# Altium schematic sheet uController_n_Ethernet.SchDoc
size 594 x 420 mm; SheetNumber: 9; SheetTotal: 11; SPICEModelCacheEHICLKKR: <root> / <DocumentId>EHICLKKR</DocumentId> / <CacheFrame Number="0"> / <Model Name="0603_885012206095_100nf" Kind="CKT"> / <Text>******* / .subckt 0603_885012206095_100nF 1 2 / Rser 1 3 0.0157659152881 / Lser 2 4 3.10171966E-10 / C1 3 4 0.0000001 / Rpar 3 4 5000000000 / .ends 0603_885012206095_100nF</Text> / </Model> / <Model Name="0603_885012106006_10uf" Kind="CKT"> / <Text>******* / .subckt 0603_885012106006_10uF 1 2 / Rser 1 3 0.00407641026021 / Lser 2 4 4.16060333E-10 / C1 3 4 0.00001 / Rpar 3 4 5000000 / .ends 0603_885012106006_10uF</Text> / </Model> / </CacheFrame> / </root>
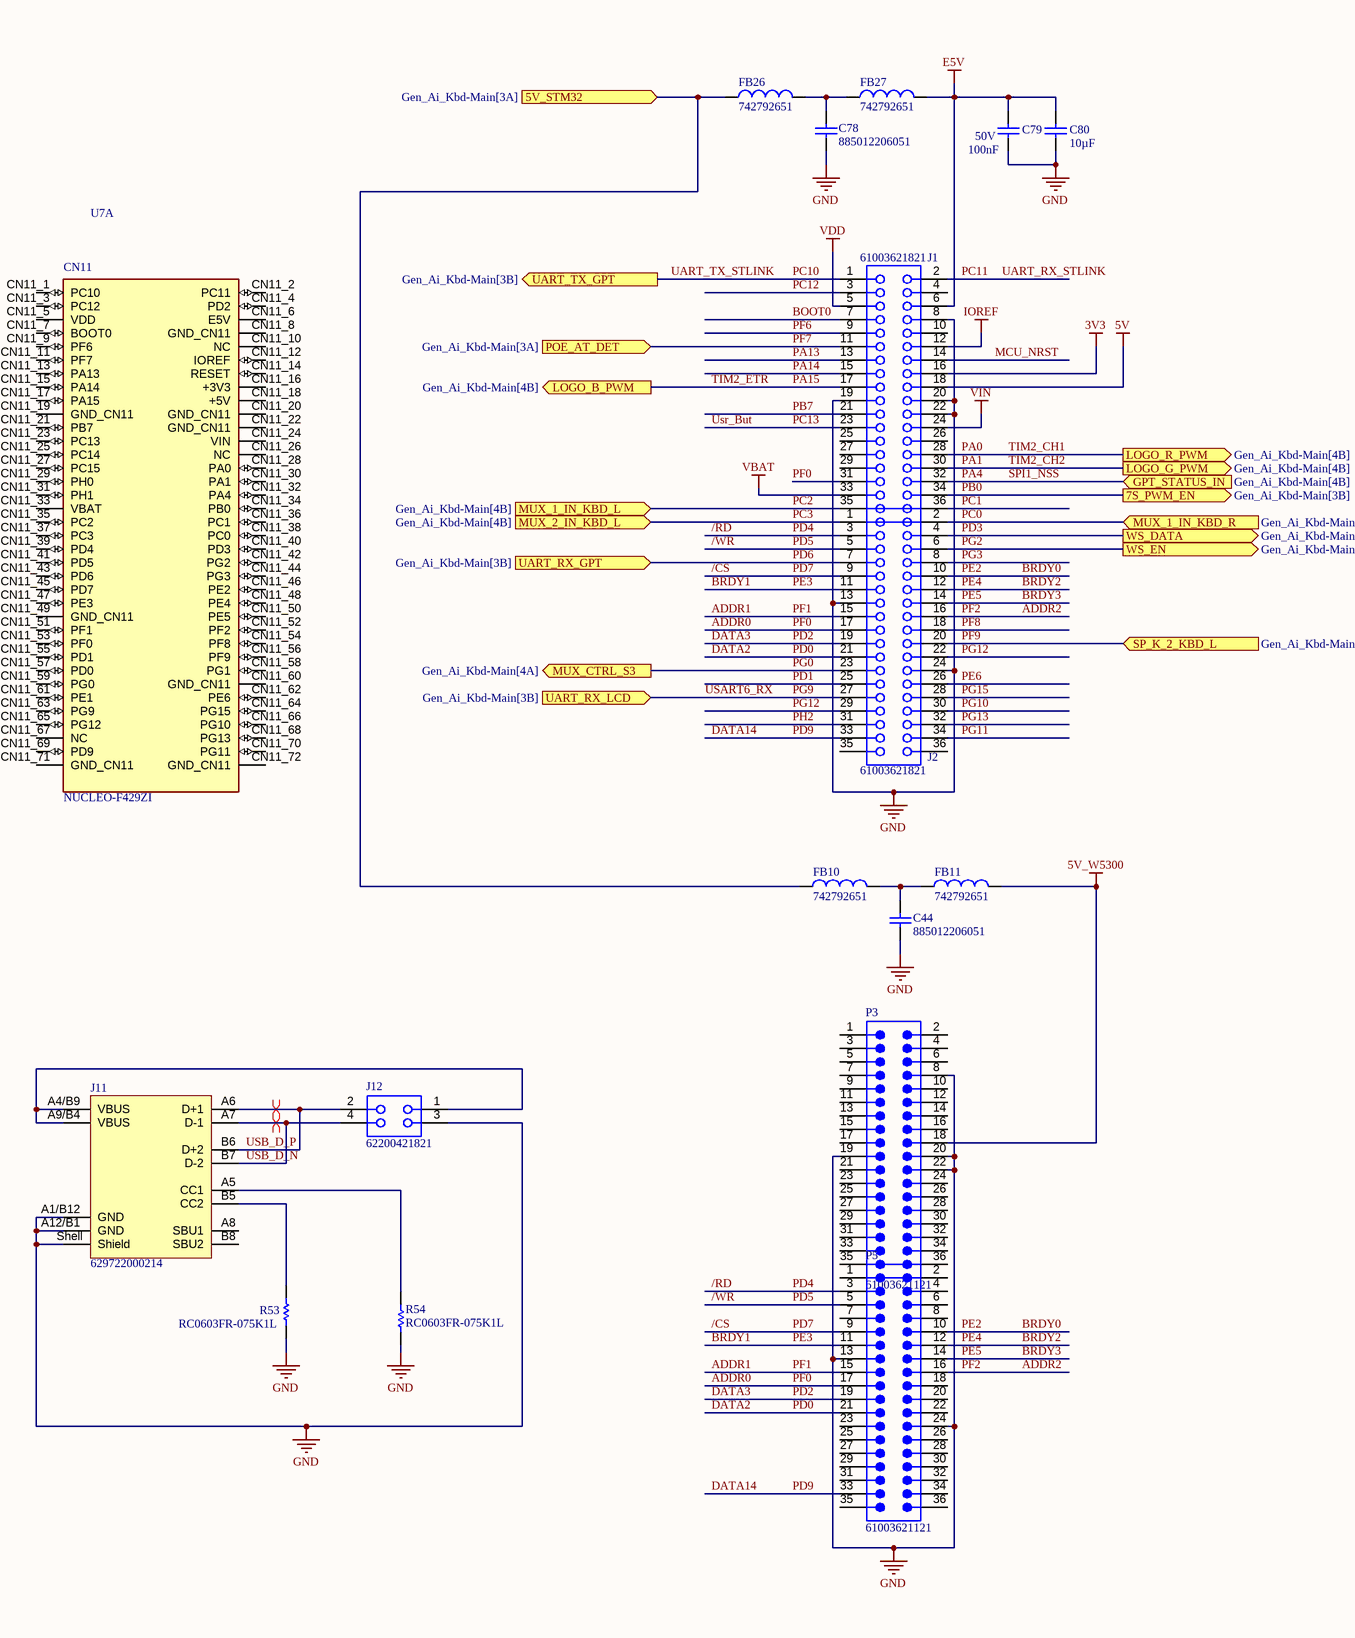
[diagram p0: uController_n_Ethernet.SchDoc, left]
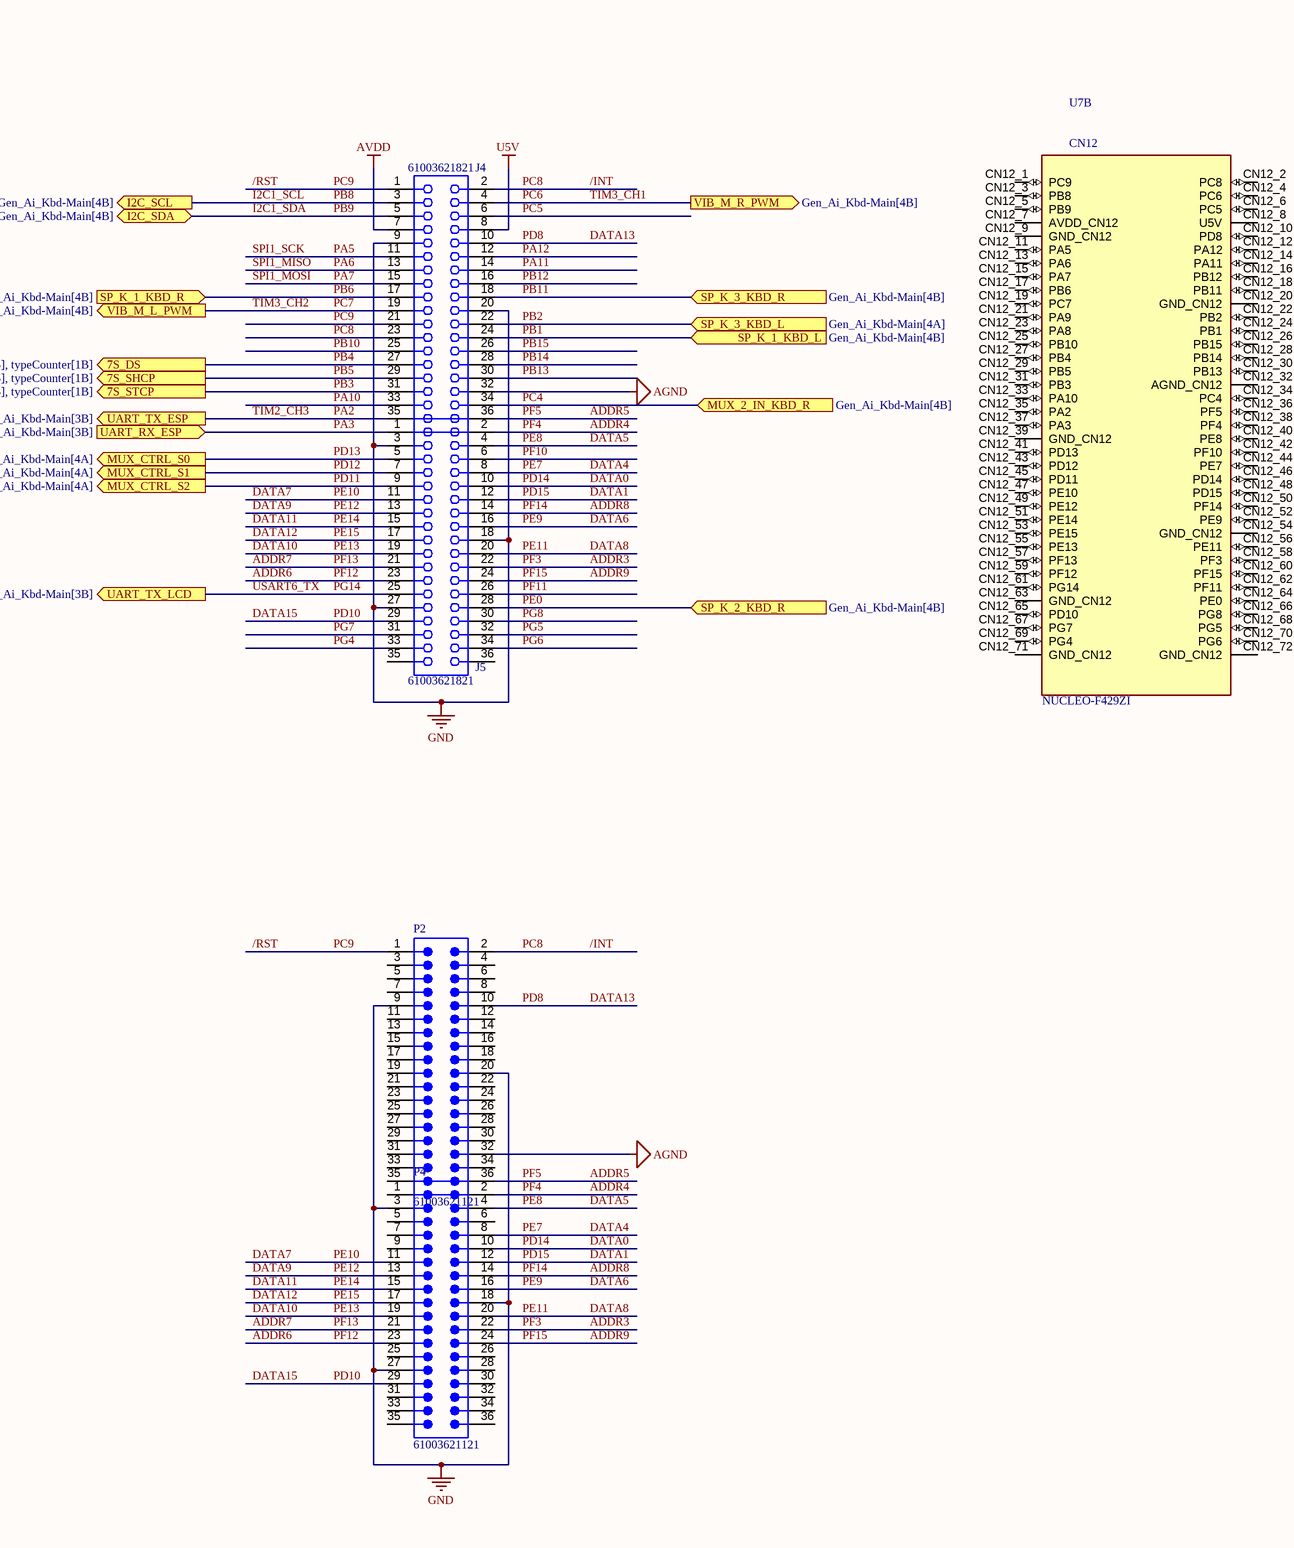
[diagram p1: uController_n_Ethernet.SchDoc, right]

## Parts
C44  885012206051  [WCAP-CSGP_0603_L1.6W0.8H0.8_Reflow]
C78  885012206051  [WCAP-CSGP_0603_L1.6W0.8H0.8_Reflow]
C79  Capacitance: 100nF  Rated Voltage (DC): 50V  [WCAP-CSGP_0603_L1.6W0.8H0.8_Reflow]  (hidden comment: 885012206095)
C80  Capacitance: 10µF  [WCAP-CSGP_0603_L1.6W0.8H0.8_Reflow]  (hidden comment: 885012106006)
FB10  742792651  [WE-CBF_0603_L1.6W0.8H0.8_HC]
FB11  742792651  [WE-CBF_0603_L1.6W0.8H0.8_HC]
FB26  742792651  [WE-CBF_0603_L1.6W0.8H0.8_HC]
FB27  742792651  [WE-CBF_0603_L1.6W0.8H0.8_HC]
J1  61003621821  [61003621821]
J2  61003621821  [61003621821]
J4  61003621821  [61003621821]
J5  61003621821  [61003621821]
J11  629722000214  [629722000214]
J12  62200421821  [62200421821]
P2  61003621121  [61003621121]
P3  61003621121  [61003621121]
P4  61003621121  [61003621121]
P5  61003621121  [61003621121]
R53  RC0603FR-075K1L  [RESC1608X55X25ML10T15]
R54  RC0603FR-075K1L  [RESC1608X55X25ML10T15]
U7  NUCLEO-F429ZI  [MODULE_NUCLEO-F429ZI]  (parts A,B of 6)

## Ports
5V_STM32 (in, see Gen_Ai_Kbd-Main[3A]), 7S_DS (out, see Gen_Ai_Kbd-Main[3B], typeCounter[1B]), 7S_PWM_EN (out, see Gen_Ai_Kbd-Main[3B]), 7S_SHCP (out, see Gen_Ai_Kbd-Main[3B], typeCounter[1B]), 7S_STCP (out, see Gen_Ai_Kbd-Main[3B], typeCounter[1B]), GPT_STATUS_IN (in, see Gen_Ai_Kbd-Main[4B]), I2C_SCL (out, see Gen_Ai_Kbd-Main[4B]), I2C_SDA (bidir, see Gen_Ai_Kbd-Main[4B]), LOGO_B_PWM (out, see Gen_Ai_Kbd-Main[4B]), LOGO_G_PWM (out, see Gen_Ai_Kbd-Main[4B]), LOGO_R_PWM (out, see Gen_Ai_Kbd-Main[4B]), MUX_1_IN_KBD_L (in, see Gen_Ai_Kbd-Main[4B]), MUX_1_IN_KBD_R (in, see Gen_Ai_Kbd-Main[4B]), MUX_2_IN_KBD_L (in, see Gen_Ai_Kbd-Main[4B]), MUX_2_IN_KBD_R (in, see Gen_Ai_Kbd-Main[4B]), MUX_CTRL_S0 (out, see Gen_Ai_Kbd-Main[4A]), MUX_CTRL_S1 (out, see Gen_Ai_Kbd-Main[4A]), MUX_CTRL_S2 (out, see Gen_Ai_Kbd-Main[4A]), MUX_CTRL_S3 (out, see Gen_Ai_Kbd-Main[4A]), POE_AT_DET (in, see Gen_Ai_Kbd-Main[3A]), SP_K_1_KBD_L (in, see Gen_Ai_Kbd-Main[4B]), SP_K_1_KBD_R (in, see Gen_Ai_Kbd-Main[4B]), SP_K_2_KBD_L (in, see Gen_Ai_Kbd-Main[4A]), SP_K_2_KBD_R (in, see Gen_Ai_Kbd-Main[4B]), SP_K_3_KBD_L (in, see Gen_Ai_Kbd-Main[4A]), SP_K_3_KBD_R (in, see Gen_Ai_Kbd-Main[4B]), UART_RX_ESP (in, see Gen_Ai_Kbd-Main[3B]), UART_RX_GPT (in, see Gen_Ai_Kbd-Main[3B]), UART_RX_LCD (in, see Gen_Ai_Kbd-Main[3B]), UART_TX_ESP (out, see Gen_Ai_Kbd-Main[3B]), UART_TX_GPT (out, see Gen_Ai_Kbd-Main[3B]), UART_TX_LCD (out, see Gen_Ai_Kbd-Main[3B]), VIB_M_L_PWM (out, see Gen_Ai_Kbd-Main[4B]), VIB_M_R_PWM (out, see Gen_Ai_Kbd-Main[4B]), WS_DATA (out, see Gen_Ai_Kbd-Main[3B]), WS_EN (out, see Gen_Ai_Kbd-Main[3B])

## Nets
3V3: J1.16
5V: J1.18
5V_W5300: FB11.2 P3.18
AGND: J4.32 P2.32
AVDD: J4.7
E5V: C79.2 C80.2 FB27.2 J1.6
GND: C44.1 C78.1 C79.1 C80.1 J1.8 J1.19 J1.20 J1.22 J2.13 J2.24 J4.9 J4.20 J5.3 J5.18 J5.27 J11.A1/B12(GND) J11.A12/B1(GND) J11.Shell(Shield) J12.3 P2.9 P2.20 P3.8 P3.19 P3.20 P3.22 P4.3 P4.18 P4.27 P5.13 P5.24 R53.1 R54.1
IOREF: J1.12
U5V: J4.8
VBAT: J1.33
VDD: J1.5
VIN: J1.24
5V_STM32: FB10.1 FB26.1 ; port 5V_STM32
/CS: J2.9 P5.9  [also labelled PD7]
/INT: J4.2 J4.23 P2.2  [also labelled PC8]
/RD: J2.3 P5.3  [also labelled PD4]
/RST: J4.1 J4.21 P2.1  [also labelled PC9]
/WR: J2.5 P5.5  [also labelled PD5]
ADDR0: J1.31 J2.17 P5.17  [also labelled PF0]
ADDR1: J2.15 P5.15  [also labelled PF1]
ADDR2: J2.16 P5.16  [also labelled PF2]
ADDR3: J5.22 P4.22  [also labelled PF3]
ADDR4: J5.2 P4.2  [also labelled PF4]
ADDR5: J4.36 P2.36  [also labelled PF5]
ADDR6: J5.23 P4.23  [also labelled PF12]
ADDR7: J5.21 P4.21  [also labelled PF13]
ADDR8: J5.14 P4.14  [also labelled PF14]
ADDR9: J5.24 P4.24  [also labelled PF15]
BOOT0: J1.7
BRDY0: J2.10 P5.10  [also labelled PE2]
BRDY1: J2.11 P5.11  [also labelled PE3]
BRDY2: J2.12 P5.12  [also labelled PE4]
BRDY3: J2.14 P5.14  [also labelled PE5]
DATA0: J5.10 P4.10  [also labelled PD14]
DATA1: J5.12 P4.12  [also labelled PD15]
DATA2: J2.21 P5.21  [also labelled PD0]
DATA3: J2.19 P5.19  [also labelled PD2]
DATA4: J5.8 P4.8  [also labelled PE7]
DATA5: J5.4 P4.4  [also labelled PE8]
DATA6: J5.16 P4.16  [also labelled PE9]
DATA7: J5.11 P4.11  [also labelled PE10]
DATA8: J5.20 P4.20  [also labelled PE11]
DATA9: J5.13 P4.13  [also labelled PE12]
DATA10: J5.19 P4.19  [also labelled PE13]
DATA11: J5.15 P4.15  [also labelled PE14]
DATA12: J5.17 P4.17  [also labelled PE15]
DATA13: J4.10 P2.10  [also labelled PD8]
DATA14: J2.33 P5.33  [also labelled PD9]
DATA15: J5.29 P4.29  [also labelled PD10]
I2C1_SCL: J4.3 ; port I2C_SCL  [also labelled PB8]
I2C1_SDA: J4.5 ; port I2C_SDA  [also labelled PB~{9}]
MCU_NRST: J1.14
PA0: J1.28 ; port LOGO_R_PWM  [also labelled TIM2_CH1]
PA1: J1.30 ; port LOGO_G_PWM  [also labelled TIM2_CH2]
PA2: J4.35 ; port UART_TX_ESP  [also labelled TIM2_CH3]
PA3: J5.1 ; port UART_RX_ESP
PA4: J1.32 ; port GPT_STATUS_IN  [also labelled SPI1_NSS]
PA5: J4.11  [also labelled SPI1_SCK]
PA6: J4.13  [also labelled SPI1_MISO]
PA7: J4.15  [also labelled SPI1_MOSI]
PA10: J4.33
PA11: J4.14
PA12: J4.12
PA13: J1.13
PA14: J1.15
PA15: J1.17 ; port LOGO_B_PWM  [also labelled TIM2_ETR]
PB0: J1.34 ; port 7S_PWM_EN
PB1: J4.24 ; port SP_K_1_KBD_L
PB2: J4.22 ; port SP_K_3_KBD_L
PB3: J4.31 ; port 7S_STCP
PB4: J4.27 ; port 7S_DS
PB5: J4.29 ; port 7S_SHCP
PB6: J4.17 ; port SP_K_1_KBD_R
PB7: J1.21
PB10: J4.25
PB11: J4.18 ; port SP_K_3_KBD_R
PB12: J4.16
PB13: J4.30
PB14: J4.28
PB15: J4.26
PC0: J2.2 ; port MUX_1_IN_KBD_R
PC1: J1.36
PC2: J1.35 ; port MUX_1_IN_KBD_L
PC3: J2.1 ; port MUX_2_IN_KBD_L
PC4: J4.34 ; port MUX_2_IN_KBD_R
PC5: J4.6
PC6: J4.4 ; port VIB_M_R_PWM  [also labelled TIM3_CH1]
PC7: J4.19 ; port VIB_M_L_PWM  [also labelled TIM3_CH2]
PC10: J1.1 ; port UART_TX_GPT  [also labelled UART_TX_STLINK]
PC11: J1.2  [also labelled UART_RX_STLINK]
PC12: J1.3
PC13: J1.23  [also labelled Usr_But]
PD1: J2.25
PD3: J2.4 ; port WS_DATA
PD6: J2.7 ; port UART_RX_GPT
PD11: J5.9 ; port MUX_CTRL_S2
PD12: J5.7 ; port MUX_CTRL_S1
PD13: J5.5 ; port MUX_CTRL_S0
PE0: J5.28 ; port SP_K_2_KBD_R
PE6: J2.26
PF6: J1.9
PF7: J1.11 ; port POE_AT_DET
PF8: J2.18
PF9: J2.20 ; port SP_K_2_KBD_L
PF10: J5.6
PF11: J5.26
PG0: J2.23 ; port MUX_CTRL_S3
PG2: J2.6 ; port WS_EN
PG3: J2.8
PG4: J5.33
PG5: J5.32
PG6: J5.34
PG7: J5.31
PG8: J5.30
PG9: J2.27 ; port UART_RX_LCD  [also labelled USART6_RX]
PG10: J2.30
PG11: J2.34
PG12: J2.22 J2.29
PG13: J2.32
PG14: J5.25 ; port UART_TX_LCD  [also labelled USART6_TX]
PG15: J2.28
PH2: J2.31
USB_D_N: J11.A7(D-1) J11.B7(D-2) J12.4
USB_D_P: J11.A6(D+1) J11.B6(D+2) J12.2
NetC44_2: C44.2 FB10.2 FB11.1
NetC78_2: C78.2 FB26.2 FB27.1
NetJ11_A4/B9: J11.A4/B9(VBUS) J11.A9/B4(VBUS) J12.1
NetJ11_A5: J11.A5(CC1) R54.2
NetJ11_B5: J11.B5(CC2) R53.2

Not connected (* = marked no-connect by the designer): J1 4 10 25 26 27 29; J2 35 36; J5 35 36; J11 A8(SBU1) B8(SBU2); P2 3 4 5 6 7 8 11 12 13 14 15 16 17 18 19 21 22 23 24 25 26 27 28 29 30 31 33 34 35; P3 1 2 3 4 5 6 7 9 10 11 12 13 14 15 16 17 21 23 24 25 26 27 28 29 30 31 32 33 34 35 36; P4 1 5 6 7 9 25 26 28 30 31 32 33 34 35 36; P5 1 2 4 6 7 8 18 20 22 23 25 26 27 28 29 30 31 32 34 35 36; U7 CN11_1(PC10) CN11_2(PC11) CN11_3(PC12) CN11_4(PD2) CN11_5(VDD) CN11_6(E5V) CN11_7(BOOT0) CN11_8(GND_CN11) CN11_9(PF6) CN11_10(NC) CN11_11(PF7) CN11_12(IOREF) CN11_13(PA13) CN11_14(RESET) CN11_15(PA14) CN11_16(+3V3) CN11_17(PA15) CN11_18(+5V) CN11_19(GND_CN11) CN11_20(GND_CN11) CN11_21(PB7) CN11_22(GND_CN11) CN11_23(PC13) CN11_24(VIN) CN11_25(PC14) CN11_26(NC) CN11_27(PC15) CN11_28(PA0) CN11_29(PH0) CN11_30(PA1) CN11_31(PH1) CN11_32(PA4) CN11_33(VBAT) CN11_34(PB0) CN11_35(PC2) CN11_36(PC1) CN11_37(PC3) CN11_38(PC0) CN11_39(PD4) CN11_40(PD3) CN11_41(PD5) CN11_42(PG2) CN11_43(PD6) CN11_44(PG3) CN11_45(PD7) CN11_46(PE2) CN11_47(PE3) CN11_48(PE4) CN11_49(GND_CN11) CN11_50(PE5) CN11_51(PF1) CN11_52(PF2) CN11_53(PF0) CN11_54(PF8) CN11_55(PD1) CN11_56(PF9) CN11_57(PD0) CN11_58(PG1) CN11_59(PG0) CN11_60(GND_CN11) CN11_61(PE1) CN11_62(PE6) CN11_63(PG9) CN11_64(PG15) CN11_65(PG12) CN11_66(PG10) CN11_67(NC) CN11_68(PG13) CN11_69(PD9) CN11_70(PG11) CN11_71(GND_CN11) CN11_72(GND_CN11) CN12_1(PC9) CN12_2(PC8) CN12_3(PB8) CN12_4(PC6) CN12_5(PB9) CN12_6(PC5) CN12_7(AVDD_CN12) CN12_8(U5V) CN12_9(GND_CN12) CN12_10(PD8) CN12_11(PA5) CN12_12(PA12) CN12_13(PA6) CN12_14(PA11) CN12_15(PA7) CN12_16(PB12) CN12_17(PB6) CN12_18(PB11) CN12_19(PC7) CN12_20(GND_CN12) CN12_21(PA9) CN12_22(PB2) CN12_23(PA8) CN12_24(PB1) CN12_25(PB10) CN12_26(PB15) CN12_27(PB4) CN12_28(PB14) CN12_29(PB5) CN12_30(PB13) CN12_31(PB3) CN12_32(AGND_CN12) CN12_33(PA10) CN12_34(PC4) CN12_35(PA2) CN12_36(PF5) CN12_37(PA3) CN12_38(PF4) CN12_39(GND_CN12) CN12_40(PE8) CN12_41(PD13) CN12_42(PF10) CN12_43(PD12) CN12_44(PE7) CN12_45(PD11) CN12_46(PD14) CN12_47(PE10) CN12_48(PD15) CN12_49(PE12) CN12_50(PF14) CN12_51(PE14) CN12_52(PE9) CN12_53(PE15) CN12_54(GND_CN12) CN12_55(PE13) CN12_56(PE11) CN12_57(PF13) CN12_58(PF3) CN12_59(PF12) CN12_60(PF15) CN12_61(PG14) CN12_62(PF11) CN12_63(GND_CN12) CN12_64(PE0) CN12_65(PD10) CN12_66(PG8) CN12_67(PG7) CN12_68(PG5) CN12_69(PG4) CN12_70(PG6) CN12_71(GND_CN12) CN12_72(GND_CN12)

## Layout directives
differential pair: USB_D_N, USB_D_P

## Notes on the sheet
- DWG NO:
- REV:
- REVISION
- DESCRIPTION
- DATE
- APPROVED
- PROJECT
- sumasta
- t
- PROJECT REVISION:
- TITLE
- DOCUMENT REVISION:
- DESIGN ITEM:
- SCALE:
- A2
- SIZE
- CAGE CODE
- FILE NAME
- DWG NO.
- SHEET
- OF
- REV
- (in symbol CMP-017-000000-2, part A) CN11
- (in symbol CMP-017-000000-2, part B) CN12

## Library data of the parts
C44 C78 = CMP-03913-53914760-1: 885012206051 Cap Cer 0.68UF 16V X7R 0603; Insulation Resistance: 700MΩ; Tolerance: 10%; Capacitance: 680nF; NexarPartId: 53914760; Dielectric: X7R; Max Operating Temperature: 125°C; Thickness: 939.8µm; Case Code (Imperial): 0603; Length: 1.6mm; RoHS: Compliant; Min Operating Temperature: -55°C; Width: 800µm; Mount: Surface Mount; Height: 800µm; Case/Package: 0603; Case Code (Metric): 1608; Voltage Rating (DC): 16V; Packaging: Tape & Reel (TR); Voltage Rating: 16V
C79 = CMP-007-000655-1: WCAP-CSGP Multilayer Ceramic Chip Capacitor, General Purpose, size 0603, X7R, 100nF, 50VDC; Manufacturer: Wurth Elektronik; Capacitance Tolerance: +/-10%; Insulation Resistance: 5GO; Case/Size Code: 0603; Technical Reference: X7R0603104K050DFCT10000; Dissipation Factor: 3%; Operating Temperature Max: 125°C; Category: Multilayer Ceramic Chip Capacitors; ComponentLink1Description: Website Link; Manufacturer Part Number: 885012206095; Pin Count: 2; Ceramic Type: X7R; Component Type: Standard; Mount: Surface Mount; Operating Temperature Min: -55°C; Source: WCAP-CSGP.SchLib; ComponentLink2URL: https://www.we-online.com/redexpert/spec/885012206095?ad; Packaging: Tape and Reel; Match Code: WCAP-CSGP; Width: 0.8mm; ComponentLink1URL: https://www.we-online.com/redexpert/article/885012206095?ad; Height: 0.8mm; Design Item ID: 885012206095; Length: 1.6mm; ComponentLink2Description: Datasheet Link
C80 = CMP-007-000403-1: WCAP-CSGP Multilayer Ceramic Chip Capacitor, General Purpose, size 0603, X5R, 10µF, 6.3VDC; Manufacturer: Wurth Elektronik; Rated Voltage (DC): 6.3V; Insulation Resistance: 0.01GO; Technical Reference: X5R0603106M6R3DFCT10000; Dissipation Factor: 10%; Case/Size Code: 0603; Capacitance Tolerance: +/-20%; Mount: Surface Mount; Packaging: Tape and Reel; ComponentLink1URL: https://www.we-online.com/redexpert/article/885012106006?ad; Height: 0.8mm; ComponentLink2URL: https://www.we-online.com/redexpert/spec/885012106006?ad; Category: Multilayer Ceramic Chip Capacitors; Operating Temperature Max: 85°C; Operating Temperature Min: -55°C; Source: WCAP-CSGP.SchLib; Match Code: WCAP-CSGP; Design Item ID: 885012106006; Ceramic Type: X5R; Manufacturer Part Number: 885012106006; Component Type: Standard; Pin Count: 2; Width: 0.8mm; ComponentLink2Description: Datasheet Link; ComponentLink1Description: Website Link; Length: 1.6mm
FB10 FB11 FB26 FB27 = CMP-0220-00181-3: NexarPartId: 7864500; RMS Current (Irms): 1A; Number of Lines: 1; Test Frequency: 100MHz; Impedance: 600Ω; Inductance: 360mH; Resistance: 200mΩ; Tolerance: 25%; Case Code (Imperial): 0603; Lead Free: Lead Free; Current Rating: 1A; Height: 800µm; Min Operating Temperature: -55°C; Core Material: Ferrite; REACH SVHC: Unknown; Case/Package: 0603; Weight: 3.997283mg; Mount: Surface Mount; Termination: SMD/SMT; Case Code (Metric): 1608; DC Resistance (DCR): 200mΩ; Series Resistance: 200mΩ; Max Operating Temperature: 125°C; Width: 800µm; Length: 1.6mm; Max DC Current: 1A; RoHS: Compliant; Material: Ferrite; Max Current Rating: 1A; Depth: 800µm; Packaging: Cut Tape (CT)
J1 J2 J4 J5 = CMP-1502-01300-2: NexarPartId: 65162132; Operating Supply Voltage: 250V; Contact Resistance: 20mΩ; Gender: Female; Current Rating: 3A; Lead Pitch: 2.54mm; Number of Pins: 36; Orientation: Vertical
J11 = CMP-207978-000003-2: Conenctor USB 2.0 Type C Horizontal SMT; NexarPartId: 129483980; USB Standard: USB 2.0; Gender: Receptacle; Current Rating: 5A; Insulation Resistance: 100MΩ; Pin Length: 950µm; Voltage Rating: 20V; Number of Contacts: 12; Height: 3.51mm; Packaging: Tape and Reel; Number of Pins: 16; Min Operating Temperature: -40°C; Max Operating Temperature: 85°C; RoHS: Compliant; Contact Material: Gold, Nickel
J12 = CMP-1502-01179-2: NexarPartId: 65162209; Contact Resistance: 20mΩ; Gender: Female; Current Rating: 1A; Operating Supply Voltage: 250V; Lead Pitch: 1.27mm; Contact Material: Copper; RoHS: Non-Compliant; Number of Pins: 4; Orientation: Vertical
P2-P5 = CMP-1502-01049-2: NexarPartId: 32855447; Gender: Male; Number of Contacts: 36; Connector Type: Male Pin; Pitch: 2.54mm; Contact Resistance: 20mΩ; Operating Supply Voltage: 250V; Current Rating: 3A; Termination: Solder; Contact Mating Length: 5.9944mm; Number of Rows: 2; REACH SVHC: Unknown; Color: Black; Contact Plating: Gold; Number of Pins: 36; Lead Pitch: 2.54mm; Mount: Surface Mount; Contact Material: Copper; Orientation: Vertical; RoHS: Compliant; Row Spacing: 2.54mm; Number of Positions: 36
R53 R54 = CMP-2000-04091-1: Manufacturer: Yageo; Part Number: RC0603FR-075K1L
U7 = CMP-017-000000-2: STM32F429ZI, mbed-Enabled Development Nucleo-144 STM32F4 ARMÂ® CortexÂ®-M4 MCU 32-Bit Embedded Evaluation Board; MF: STMicroelectronics; Component Type: Standard; Check_prices: https://www.snapeda.com/parts/NUCLEO-F429ZI/STMicroelectronics/view-part/?ref=eda; SnapEDA_Link: https://www.snapeda.com/parts/NUCLEO-F429ZI/STMicroelectronics/view-part/?ref=snap; Price: None; Design Item ID: NUCLEO-F429ZI; Value: *; Package: None; Availability: In Stock; Purchase-URL: https://pricing.snapeda.com/search/part/NUCLEO-F429ZI/?ref=eda; Source: NUCLEO-F429ZI.SchLib; MP: NUCLEO-F429ZI; Pin Count: 244